# Altium schematic sheet AnalogPart.SchDoc
size 594 x 420 mm; Scale: 1:1; DocumentType: Схема электрическая принципиальная; FirstReferrence: АБВГ.123456.001
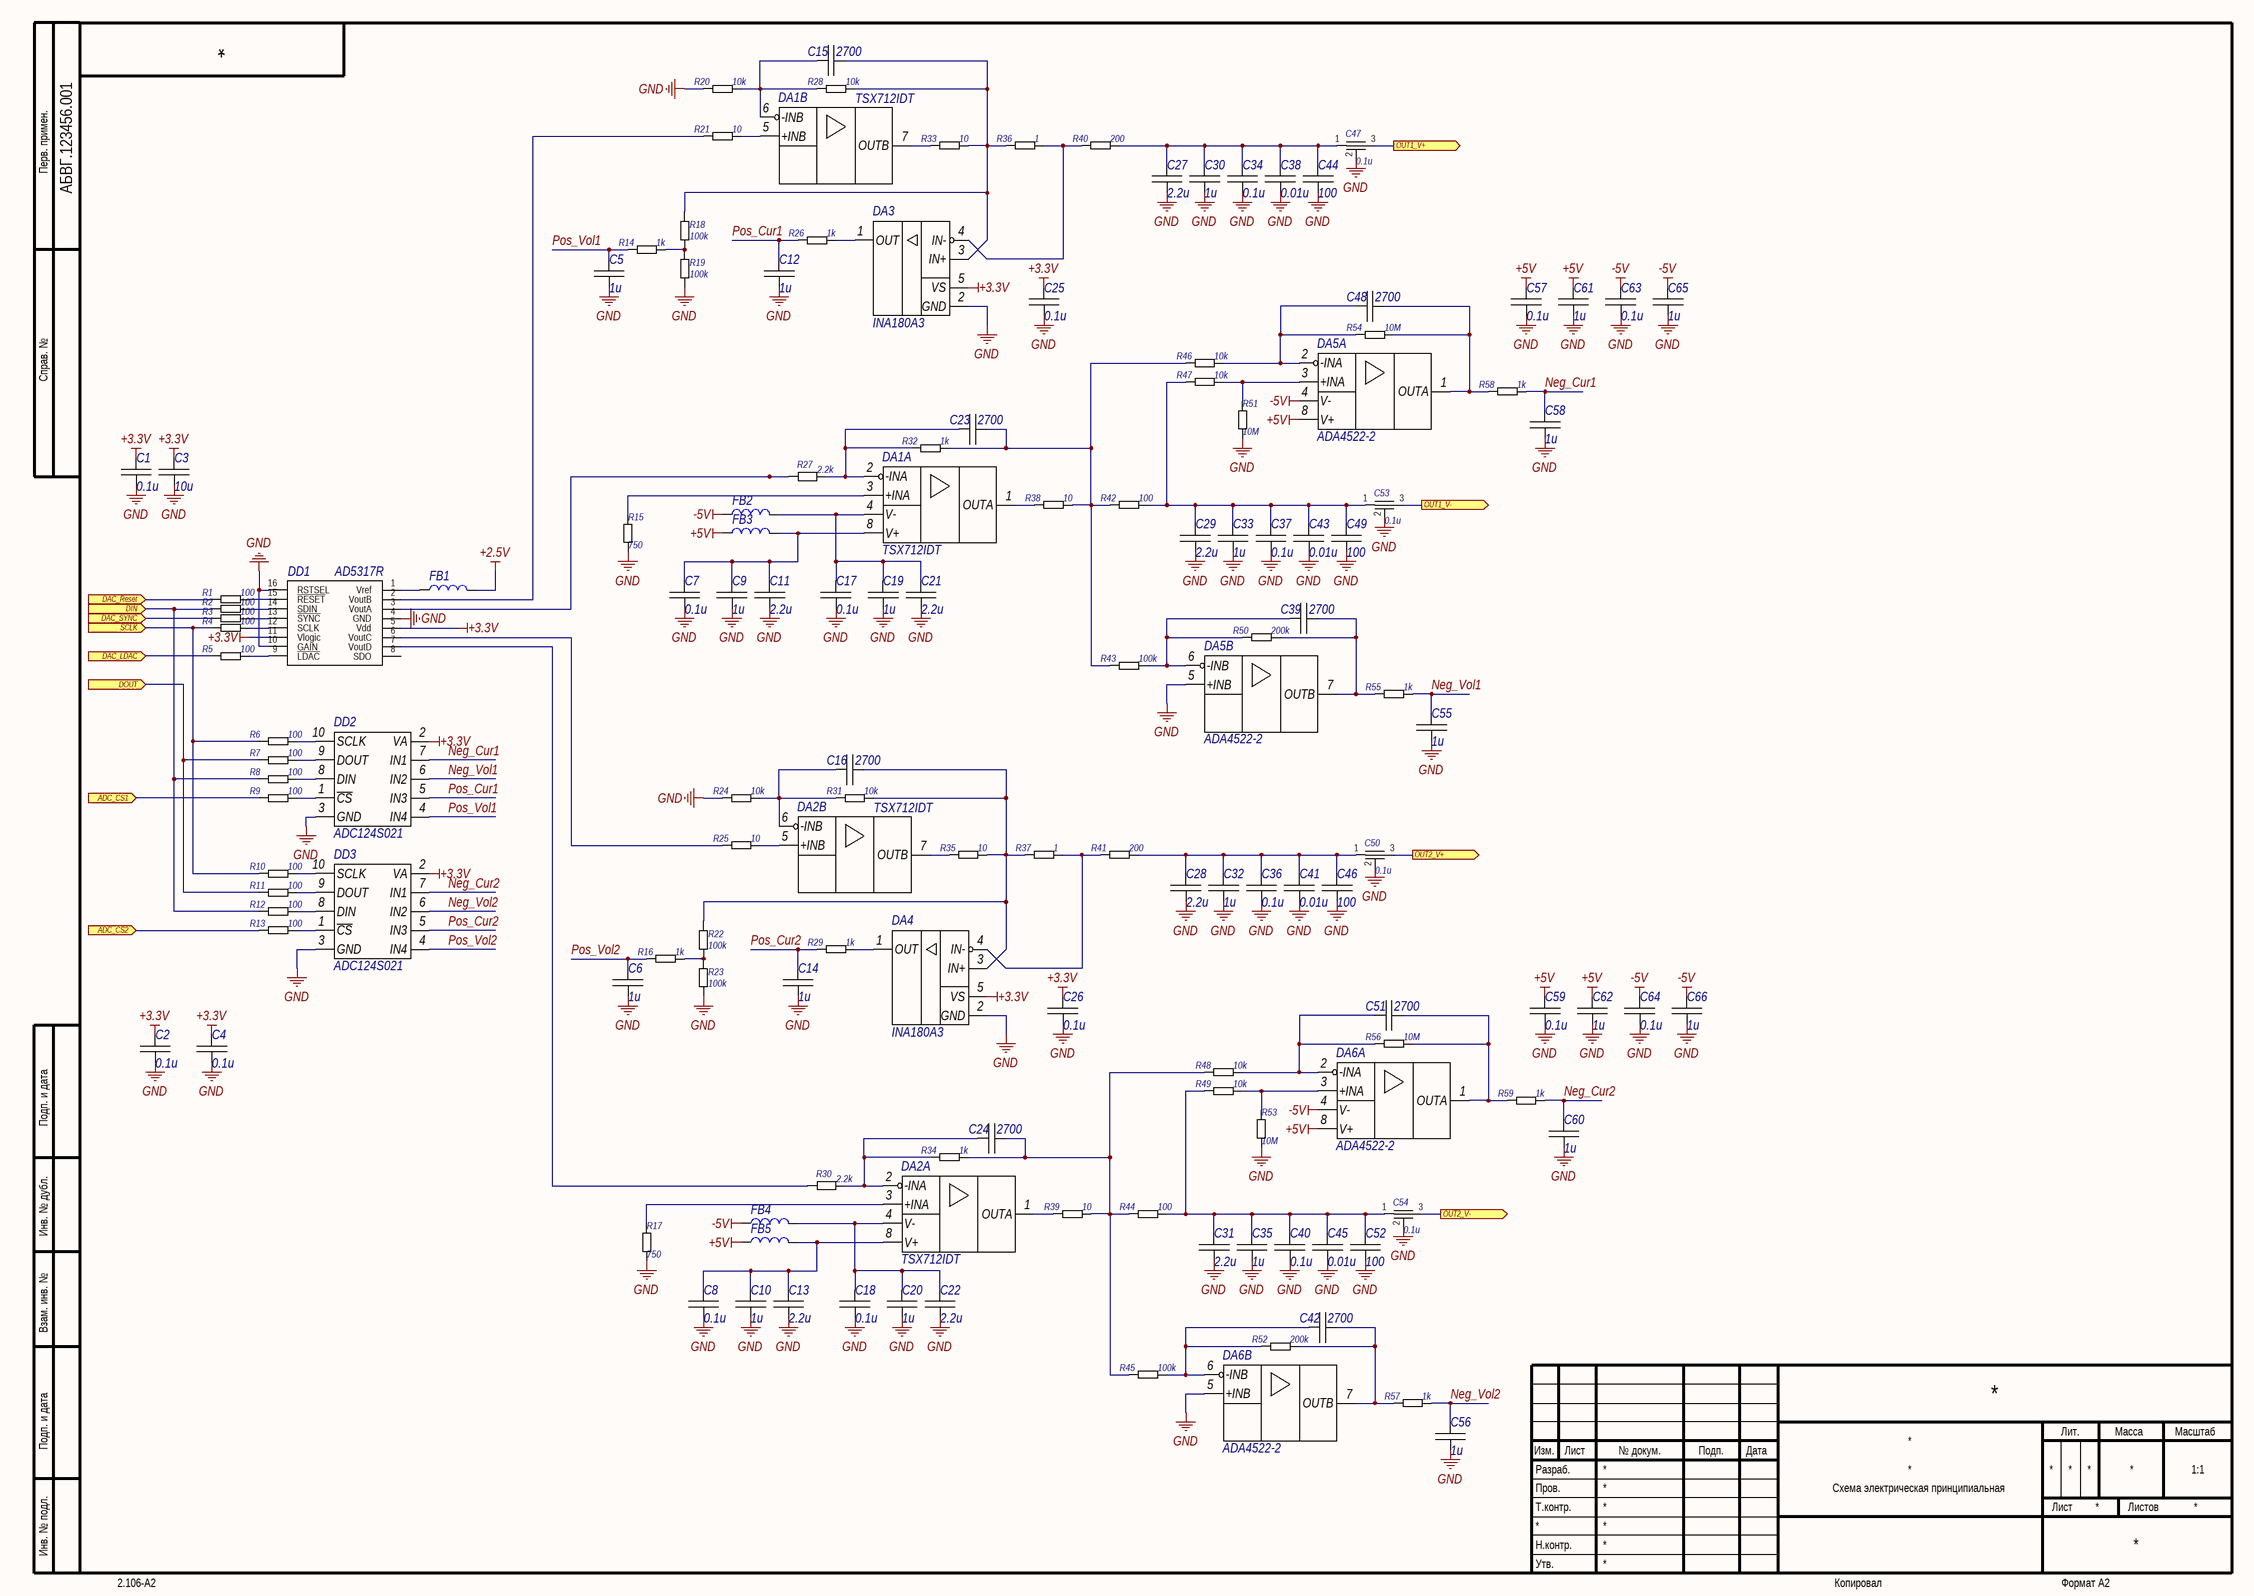
[diagram p0: AnalogPart.SchDoc]

## Parts
C1  0.1u  [C0603]
C2  0.1u  [C0603]
C3  10u  [C0805]
C4  0.1u  [C0603]
C5  1u  [C0805]
C6  1u  [C0805]
C7  0.1u  [C0603]
C8  0.1u  [C0603]
C9  1u  [C0805]
C10  1u  [C0805]
C11  2.2u  [C0805]
C12  1u  [C0805]
C13  2.2u  [C0805]
C14  1u  [C0805]
C15  2700  [C0805]
C16  2700  [C0805]
C17  0.1u  [C0603]
C18  0.1u  [C0603]
C19  1u  [C0805]
C20  1u  [C0805]
C21  2.2u  [C0805]
C22  2.2u  [C0805]
C23  2700  [C0805]
C24  2700  [C0805]
C25  0.1u  [C0603]
C26  0.1u  [C0603]
C27  2.2u  [C0805]
C28  2.2u  [C0805]
C29  2.2u  [C0805]
C30  1u  [C0805]
C31  2.2u  [C0805]
C32  1u  [C0805]
C33  1u  [C0805]
C34  0.1u  [C0805]
C35  1u  [C0805]
C36  0.1u  [C0805]
C37  0.1u  [C0805]
C38  0.01u  [C0805]
C39  2700  [C0805]
C40  0.1u  [C0805]
C41  0.01u  [C0805]
C42  2700  [C0805]
C43  0.01u  [C0805]
C44  100  [C0805]
C45  0.01u  [C0805]
C46  100  [C0805]
C47  0.1u  [T0805]
C48  2700  [C0805]
C49  100  [C0805]
C50  0.1u  [T0805]
C51  2700  [C0805]
C52  100  [C0805]
C53  0.1u  [T0805]
C54  0.1u  [T0805]
C55  1u  [C0805]
C56  1u  [C0805]
C57  0.1u  [C0603]
C58  1u  [C0805]
C59  0.1u  [C0603]
C60  1u  [C0805]
C61  1u  [C0805]
C62  1u  [C0805]
C63  0.1u  [C0603]
C64  0.1u  [C0603]
C65  1u  [C0805]
C66  1u  [C0805]
DA1  TSX712IDT  [SOIC-8]  (parts A,B of 2)
DA2  TSX712IDT  [SOIC-8]  (parts A,B of 2)
DA3  INA180A3  [SOT23-5]
DA4  INA180A3  [SOT23-5]
DA5  ADA4522-2  [TSSOP-8]  (parts A,B of 2)
DA6  ADA4522-2  [TSSOP-8]  (parts A,B of 2)
DD1  AD5317R  [TSSOP-16]
DD2  ADC124S021  [VSSOP-10]
DD3  ADC124S021  [VSSOP-10]
FB1  MH1608-601Y  [L0603]  (value not drawn)
FB2  MH1608-601Y  [L0603]  (value not drawn)
FB3  MH1608-601Y  [L0603]  (value not drawn)
FB4  MH1608-601Y  [L0603]  (value not drawn)
FB5  MH1608-601Y  [L0603]  (value not drawn)
R1  100  [CR0603]
R2  100  [CR0603]
R3  100  [CR0603]
R4  100  [CR0603]
R5  100  [CR0603]
R6  100  [CR0603]
R7  100  [CR0603]
R8  100  [CR0603]
R9  100  [CR0603]
R10  100  [CR0603]
R11  100  [CR0603]
R12  100  [CR0603]
R13  100  [CR0603]
R14  1k  [CR0805]
R15  750  [CR0805]
R16  1k  [CR0805]
R17  750  [CR0805]
R18  100k  [CR0805]
R19  100k  [CR0805]
R20  10k  [CR0805]
R21  10  [CR0805]
R22  100k  [CR0805]
R23  100k  [CR0805]
R24  10k  [CR0805]
R25  10  [CR0805]
R26  1k  [CR0805]
R27  2.2k  [CR0805]
R28  10k  [CR0805]
R29  1k  [CR0805]
R30  2.2k  [CR0805]
R31  10k  [CR0805]
R32  1k  [CR0805]
R33  10  [CR0805]
R34  1k  [CR0805]
R35  10  [CR0805]
R36  1  [CR0805]
R37  1  [CR0805]
R38  10  [CR0805]
R39  10  [CR0805]
R40  200  [CR0805]
R41  200  [CR0805]
R42  100  [CR0805]
R43  100k  [CR0805]
R44  100  [CR0805]
R45  100k  [CR0805]
R46  10k  [CR0805]
R47  10k  [CR0805]
R48  10k  [CR0805]
R49  10k  [CR0805]
R50  200k  [CR0805]
R51  10M  [CR0805]
R52  200k  [CR0805]
R53  10M  [CR0805]
R54  10M  [CR0805]
R55  1k  [CR0805]
R56  10M  [CR0805]
R57  1k  [CR0805]
R58  1k  [CR0805]
R59  1k  [CR0805]

## Ports
ADC_CS1 (in), ADC_CS2 (in), DAC_LDAC (in), DAC_Reset (in), DAC_SYNC (in), DIN (in), DOUT (in), OUT1_V+ (out), OUT1_V- (out), OUT2_V+ (out), OUT2_V- (out), SCLK (in)

## Nets
+2.5V: FB1.2
+3.3V: C1.1 C2.1 C3.1 C4.1 C25.1 C26.1 DA3.5(VS) DA4.5(VS) DD1.5(Vdd) DD1.11(Vlogic) DD2.2(VA) DD3.2(VA)
+5V: C57.1 C59.1 C61.1 C62.1 DA5.8(V+) DA6.8(V+) FB3.1 FB5.1
-5V: C63.1 C64.1 C65.1 C66.1 DA5.4(V-) DA6.4(V-) FB2.1 FB4.1
GND: C1.2 C2.2 C3.2 C4.2 C5.2 C6.2 C7.2 C8.2 C9.2 C10.2 C11.2 C12.2 C13.2 C14.2 C17.2 C18.2 C19.2 C20.2 C21.2 C22.2 C25.2 C26.2 C27.2 C28.2 C29.2 C30.2 C31.2 C32.2 C33.2 C34.2 C35.2 C36.2 C37.2 C38.2 C40.2 C41.2 C43.2 C44.2 C45.2 C46.2 C47.2 C49.2 C50.2 C52.2 C53.2 C54.2 C55.2 C56.2 C57.2 C58.2 C59.2 C60.2 C61.2 C62.2 C63.2 C64.2 C65.2 C66.2 DA3.2(GND) DA4.2(GND) DA5.5(+INB) DA6.5(+INB) DD1.4(GND) DD1.10(GAIN) DD1.16(RSTSEL) DD2.3(GND) DD3.3(GND) R15.1 R17.1 R19.2 R20.2 R23.2 R24.2 R51.1 R53.1
ADC_CS1: R9.1 ; port ADC_CS1
ADC_CS2: R13.1 ; port ADC_CS2
DAC_LDAC: R5.1 ; port DAC_LDAC
DAC_Reset: R1.1 ; port DAC_Reset
DAC_SYNC: R3.1 ; port DAC_SYNC
DIN: R2.1 R8.1 R12.1 ; port DIN
DOUT: R7.1 R11.1 ; port DOUT
Neg_Cur1: C58.1 DD2.7(IN1) R58.2
Neg_Cur2: C60.1 DD3.7(IN1) R59.2
Neg_Vol1: C55.1 DD2.6(IN2) R55.2
Neg_Vol2: C56.1 DD3.6(IN2) R57.2
OUT1_V+: C47.3 ; port OUT1_V+
OUT1_V-: C53.3 ; port OUT1_V-
OUT2_V+: C50.3 ; port OUT2_V+
OUT2_V-: C54.3 ; port OUT2_V-
Pos_Cur1: C12.1 DD2.5(IN3) R26.1
Pos_Cur2: C14.1 DD3.5(IN3) R29.1
Pos_Vol1: C5.1 DD2.4(IN4) R14.1
Pos_Vol2: C6.1 DD3.4(IN4) R16.1
SCLK: R4.1 R6.1 R10.1 ; port SCLK
NetC7_1: C7.1 C9.1 C11.1 DA1.8(V+) FB3.2
NetC8_1: C8.1 C10.1 C13.1 DA2.8(V+) FB5.2
NetC15_1: C15.1 DA1.6(-INB) R20.1 R28.1
NetC15_2: C15.2 DA3.3(IN+) R18.2 R28.2 R33.2 R36.1
NetC16_1: C16.1 DA2.6(-INB) R24.1 R31.1
NetC16_2: C16.2 DA4.3(IN+) R22.2 R31.2 R35.2 R37.1
NetC17_1: C17.1 C19.1 C21.1 DA1.4(V-) FB2.2
NetC18_1: C18.1 C20.1 C22.1 DA2.4(V-) FB4.2
NetC23_1: C23.1 DA1.2(-INA) R27.1 R32.2
NetC23_2: C23.2 R32.1 R38.2 R42.1 R43.1 R46.1
NetC24_1: C24.1 DA2.2(-INA) R30.1 R34.2
NetC24_2: C24.2 R34.1 R39.2 R44.1 R45.1 R48.1
NetC27_1: C27.1 C30.1 C34.1 C38.1 C44.1 C47.1 R40.2
NetC28_1: C28.1 C32.1 C36.1 C41.1 C46.1 C50.1 R41.2
NetC29_1: C29.1 C33.1 C37.1 C43.1 C49.1 C53.1 R42.2 R47.1
NetC31_1: C31.1 C35.1 C40.1 C45.1 C52.1 C54.1 R44.2 R49.1
NetC39_1: C39.1 DA5.6(-INB) R43.2 R50.1
NetC39_2: C39.2 DA5.7(OUTB) R50.2 R55.1
NetC42_1: C42.1 DA6.6(-INB) R45.2 R52.1
NetC42_2: C42.2 DA6.7(OUTB) R52.2 R57.1
NetC48_1: C48.1 DA5.2(-INA) R46.2 R54.1
NetC48_2: C48.2 DA5.1(OUTA) R54.2 R58.1
NetC51_1: C51.1 DA6.2(-INA) R48.2 R56.1
NetC51_2: C51.2 DA6.1(OUTA) R56.2 R59.1
NetDA1_1: DA1.1(OUTA) R38.1
NetDA1_3: DA1.3(+INA) R15.2
NetDA1_5: DA1.5(+INB) R21.1
NetDA1_7: DA1.7(OUTB) R33.1
NetDA2_1: DA2.1(OUTA) R39.1
NetDA2_3: DA2.3(+INA) R17.2
NetDA2_5: DA2.5(+INB) R25.1
NetDA2_7: DA2.7(OUTB) R35.1
NetDA3_1: DA3.1(OUT) R26.2
NetDA3_4: DA3.4(IN-) R36.2 R40.1
NetDA4_1: DA4.1(OUT) R29.2
NetDA4_4: DA4.4(IN-) R37.2 R41.1
NetDA5_3: DA5.3(+INA) R47.2 R51.2
NetDA6_3: DA6.3(+INA) R49.2 R53.2
NetDD1_1: DD1.1(Vref) FB1.1
NetDD1_2: DD1.2(VoutB) R21.2
NetDD1_3: DD1.3(VoutA) R27.2
NetDD1_6: DD1.6(VoutC) R25.2
NetDD1_7: DD1.7(VoutD) R30.2
NetDD1_9: DD1.9(~{LDAC}) R5.2
NetDD1_12: DD1.12(SCLK) R4.2
NetDD1_13: DD1.13(~{SYNC}) R3.2
NetDD1_14: DD1.14(SDIN) R2.2
NetDD1_15: DD1.15(~{RESET}) R1.2
NetDD2_1: DD2.1(~{CS}) R9.2
NetDD2_8: DD2.8(DIN) R8.2
NetDD2_9: DD2.9(DOUT) R7.2
NetDD2_10: DD2.10(SCLK) R6.2
NetDD3_1: DD3.1(~{CS}) R13.2
NetDD3_8: DD3.8(DIN) R12.2
NetDD3_9: DD3.9(DOUT) R11.2
NetDD3_10: DD3.10(SCLK) R10.2
NetR14_2: R14.2 R18.1 R19.1
NetR16_2: R16.2 R22.1 R23.1

Not connected (* = marked no-connect by the designer): DD1 8(SDO)

## Notes on the sheet
- Перв. примен.
- Справ. №
- Подп. и дата
- Инв. № дубл.
- Взам. инв. №
- Разраб.
- Изм.
- Лист
- № докум.
- Подп.
- Дата
- Лит.
- Масса
- Масштаб
- Пров.
- Т.контр.
- Листов
- Инв. № подл.
- Утв.
- Н.контр.
- 2.106-A2
- Копировал
- Формат А2

## Library data of the parts
C1-C46 C48 C49 C51 C52 C55-C66 = Capacitor Ceramic SMD
C47 C50 C53 C54 = Cap 3 terminal
DA1 DA2 = ADA4522-2
DA3 DA4 = INA180Ax
FB1-FB5 = Ferrite Bead
R1-R59 = Resistor SMD